# Altium project LED kocka.PrjPcb
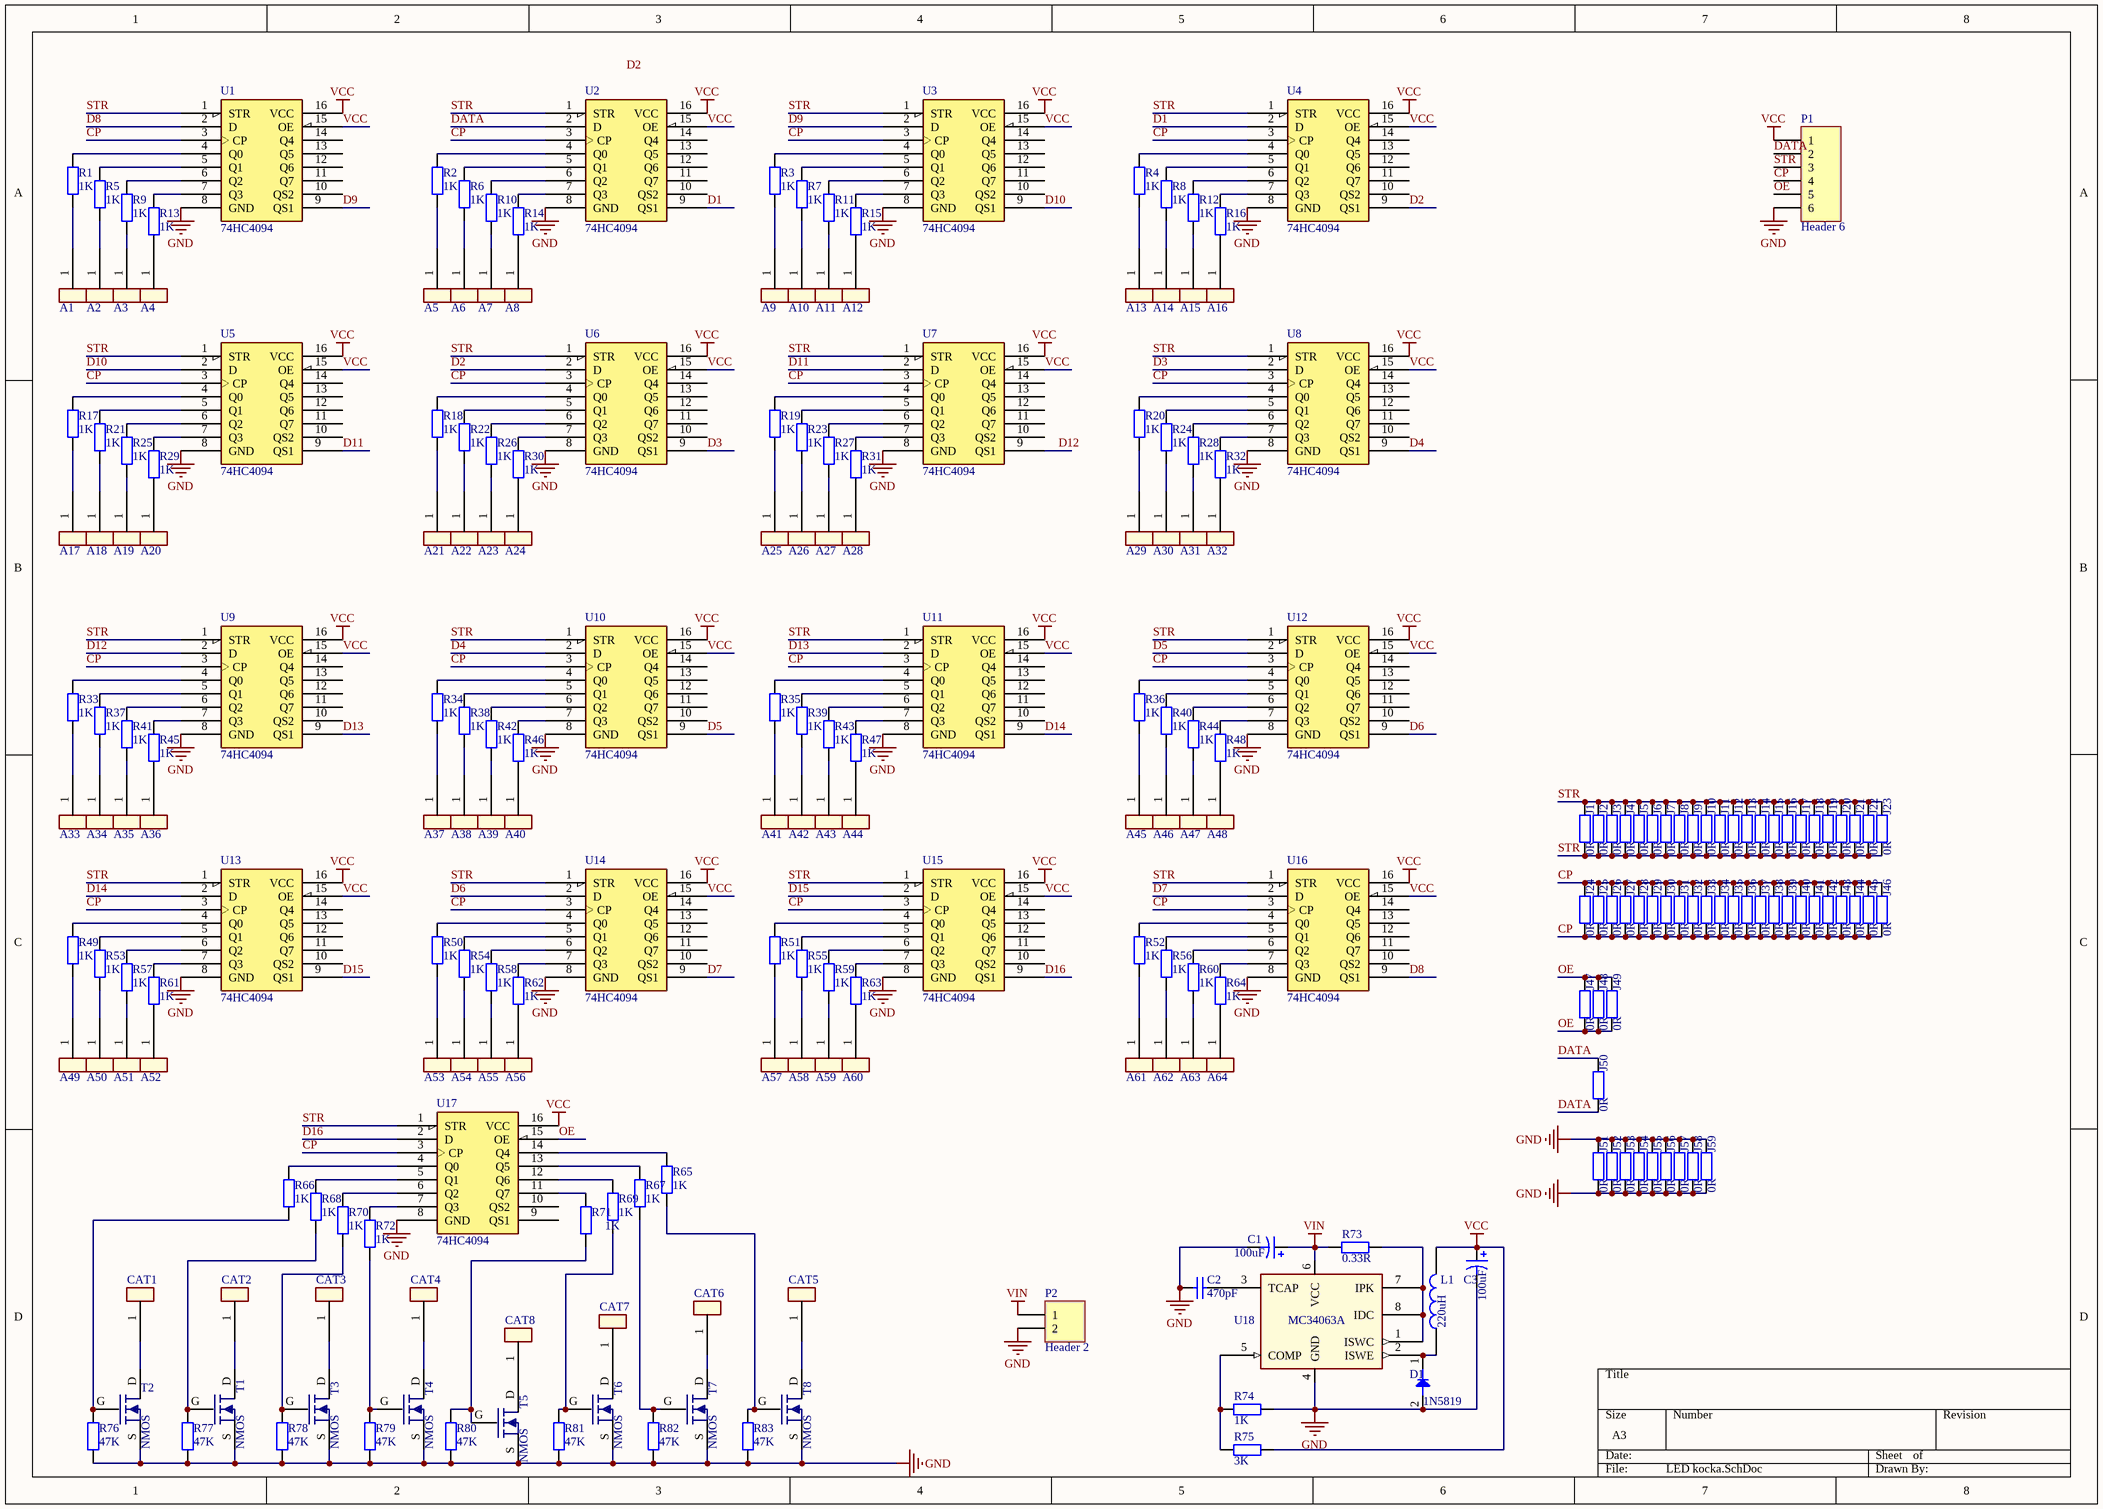
[diagram p0: LED kocka.SchDoc]
1 sheet, 247 parts. Net scope: global (net labels, ports and power ports of the same name join across sheets).
Board file: LED kocka.PcbDoc

## Sheet LED kocka.SchDoc
size A3

### Parts
A1  (no value)  [via_300x400]
A2  (no value)  [via_300x400]
A3  (no value)  [via_300x400]
A4  (no value)  [via_300x400]
A5  (no value)  [via_300x400]
A6  (no value)  [via_300x400]
A7  (no value)  [via_300x400]
A8  (no value)  [via_300x400]
A9  (no value)  [via_300x400]
A10  (no value)  [via_300x400]
A11  (no value)  [via_300x400]
A12  (no value)  [via_300x400]
A13  (no value)  [via_300x400]
A14  (no value)  [via_300x400]
A15  (no value)  [via_300x400]
A16  (no value)  [via_300x400]
A17  (no value)  [via_300x400]
A18  (no value)  [via_300x400]
A19  (no value)  [via_300x400]
A20  (no value)  [via_300x400]
A21  (no value)  [via_300x400]
A22  (no value)  [via_300x400]
A23  (no value)  [via_300x400]
A24  (no value)  [via_300x400]
A25  (no value)  [via_300x400]
A26  (no value)  [via_300x400]
A27  (no value)  [via_300x400]
A28  (no value)  [via_300x400]
A29  (no value)  [via_300x400]
A30  (no value)  [via_300x400]
A31  (no value)  [via_300x400]
A32  (no value)  [via_300x400]
A33  (no value)  [via_300x400]
A34  (no value)  [via_300x400]
A35  (no value)  [via_300x400]
A36  (no value)  [via_300x400]
A37  (no value)  [via_300x400]
A38  (no value)  [via_300x400]
A39  (no value)  [via_300x400]
A40  (no value)  [via_300x400]
A41  (no value)  [via_300x400]
A42  (no value)  [via_300x400]
A43  (no value)  [via_300x400]
A44  (no value)  [via_300x400]
A45  (no value)  [via_300x400]
A46  (no value)  [via_300x400]
A47  (no value)  [via_300x400]
A48  (no value)  [via_300x400]
A49  (no value)  [via_300x400]
A50  (no value)  [via_300x400]
A51  (no value)  [via_300x400]
A52  (no value)  [via_300x400]
A53  (no value)  [via_300x400]
A54  (no value)  [via_300x400]
A55  (no value)  [via_300x400]
A56  (no value)  [via_300x400]
A57  (no value)  [via_300x400]
A58  (no value)  [via_300x400]
A59  (no value)  [via_300x400]
A60  (no value)  [via_300x400]
A61  (no value)  [via_300x400]
A62  (no value)  [via_300x400]
A63  (no value)  [via_300x400]
A64  (no value)  [via_300x400]
C1  100uF  [FP_CAP_ELKO_6,3X6,3]
C2  470pF  [FP_0805_CAP_085]
C3  100uF  [FP_CAP_ELKO_6,3X6,3]
CAT1  (no value)  [via_300x400]
CAT2  (no value)  [via_300x400]
CAT3  (no value)  [via_300x400]
CAT4  (no value)  [via_300x400]
CAT5  (no value)  [via_300x400]
CAT6  (no value)  [via_300x400]
CAT7  (no value)  [via_300x400]
CAT8  (no value)  [via_300x400]
D1  1N5819  [FP_SOD-123]
J1  0R  [FP_1206_RES_SIMPLE]
J2  0R  [FP_1206_RES_SIMPLE]
J3  0R  [FP_1206_RES_SIMPLE]
J4  0R  [FP_1206_RES_SIMPLE]
J5  0R  [FP_1206_RES_SIMPLE]
J6  0R  [FP_1206_RES_SIMPLE]
J7  0R  [FP_1206_RES_SIMPLE]
J8  0R  [FP_1206_RES_SIMPLE]
J9  0R  [FP_1206_RES_SIMPLE]
J10  0R  [FP_1206_RES_SIMPLE]
J11  0R  [FP_1206_RES_SIMPLE]
J12  0R  [FP_1206_RES_SIMPLE]
J13  0R  [FP_1206_RES_SIMPLE]
J14  0R  [FP_1206_RES_SIMPLE]
J15  0R  [FP_1206_RES_SIMPLE]
J16  0R  [FP_1206_RES_SIMPLE]
J17  0R  [FP_1206_RES_SIMPLE]
J18  0R  [FP_1206_RES_SIMPLE]
J19  0R  [FP_1206_RES_SIMPLE]
J20  0R  [FP_1206_RES_SIMPLE]
J21  0R  [FP_1206_RES_SIMPLE]
J22  0R  [FP_1206_RES_SIMPLE]
J23  0R  [FP_1206_RES_SIMPLE]
J24  0R  [FP_1206_RES_SIMPLE]
J25  0R  [FP_1206_RES_SIMPLE]
J26  0R  [FP_1206_RES_SIMPLE]
J27  0R  [FP_1206_RES_SIMPLE]
J28  0R  [FP_1206_RES_SIMPLE]
J29  0R  [FP_1206_RES_SIMPLE]
J30  0R  [FP_1206_RES_SIMPLE]
J31  0R  [FP_1206_RES_SIMPLE]
J32  0R  [FP_1206_RES_SIMPLE]
J33  0R  [FP_1206_RES_SIMPLE]
J34  0R  [FP_1206_RES_SIMPLE]
J35  0R  [FP_1206_RES_SIMPLE]
J36  0R  [FP_1206_RES_SIMPLE]
J37  0R  [FP_1206_RES_SIMPLE]
J38  0R  [FP_1206_RES_SIMPLE]
J39  0R  [FP_1206_RES_SIMPLE]
J40  0R  [FP_1206_RES_SIMPLE]
J41  0R  [FP_1206_RES_SIMPLE]
J42  0R  [FP_1206_RES_SIMPLE]
J43  0R  [FP_1206_RES_SIMPLE]
J44  0R  [FP_1206_RES_SIMPLE]
J45  0R  [FP_1206_RES_SIMPLE]
J46  0R  [FP_1206_RES_SIMPLE]
J47  0R  [FP_1206_RES_SIMPLE]
J48  0R  [FP_1206_RES_SIMPLE]
J49  0R  [FP_1206_RES_SIMPLE]
J50  0R  [FP_1206_RES_SIMPLE]
J51  0R  [FP_1206_RES_SIMPLE]
J52  0R  [FP_1206_RES_SIMPLE]
J53  0R  [FP_1206_RES_SIMPLE]
J54  0R  [FP_1206_RES_SIMPLE]
J55  0R  [FP_1206_RES_SIMPLE]
J56  0R  [FP_1206_RES_SIMPLE]
J57  0R  [FP_1206_RES_SIMPLE]
J58  0R  [FP_1206_RES_SIMPLE]
J59  0R  [FP_1206_RES_SIMPLE]
L1  220uH  [FP_IND_MURATA3131]
P1  Header 6  [HDR1X6]
P2  Header 2  [FP_DC_TAP_ANYA]
R1  1K  [FP_0603_RES]
R2  1K  [FP_0603_RES]
R3  1K  [FP_0603_RES]
R4  1K  [FP_0603_RES]
R5  1K  [FP_0603_RES]
R6  1K  [FP_0603_RES]
R7  1K  [FP_0603_RES]
R8  1K  [FP_0603_RES]
R9  1K  [FP_0603_RES]
R10  1K  [FP_0603_RES]
R11  1K  [FP_0603_RES]
R12  1K  [FP_0603_RES]
R13  1K  [FP_0603_RES]
R14  1K  [FP_0603_RES]
R15  1K  [FP_0603_RES]
R16  1K  [FP_0603_RES]
R17  1K  [FP_0603_RES]
R18  1K  [FP_0603_RES]
R19  1K  [FP_0603_RES]
R20  1K  [FP_0603_RES]
R21  1K  [FP_0603_RES]
R22  1K  [FP_0603_RES]
R23  1K  [FP_0603_RES]
R24  1K  [FP_0603_RES]
R25  1K  [FP_0603_RES]
R26  1K  [FP_0603_RES]
R27  1K  [FP_0603_RES]
R28  1K  [FP_0603_RES]
R29  1K  [FP_0603_RES]
R30  1K  [FP_0603_RES]
R31  1K  [FP_0603_RES]
R32  1K  [FP_0603_RES]
R33  1K  [FP_0603_RES]
R34  1K  [FP_0603_RES]
R35  1K  [FP_0603_RES]
R36  1K  [FP_0603_RES]
R37  1K  [FP_0603_RES]
R38  1K  [FP_0603_RES]
R39  1K  [FP_0603_RES]
R40  1K  [FP_0603_RES]
R41  1K  [FP_0603_RES]
R42  1K  [FP_0603_RES]
R43  1K  [FP_0603_RES]
R44  1K  [FP_0603_RES]
R45  1K  [FP_0603_RES]
R46  1K  [FP_0603_RES]
R47  1K  [FP_0603_RES]
R48  1K  [FP_0603_RES]
R49  1K  [FP_0603_RES]
R50  1K  [FP_0603_RES]
R51  1K  [FP_0603_RES]
R52  1K  [FP_0603_RES]
R53  1K  [FP_0603_RES]
R54  1K  [FP_0603_RES]
R55  1K  [FP_0603_RES]
R56  1K  [FP_0603_RES]
R57  1K  [FP_0603_RES]
R58  1K  [FP_0603_RES]
R59  1K  [FP_0603_RES]
R60  1K  [FP_0603_RES]
R61  1K  [FP_0603_RES]
R62  1K  [FP_0603_RES]
R63  1K  [FP_0603_RES]
R64  1K  [FP_0603_RES]
R65  1K  [FP_0603_RES]
R66  1K  [FP_0603_RES]
R67  1K  [FP_0603_RES]
R68  1K  [FP_0603_RES]
R69  1K  [FP_0603_RES]
R70  1K  [FP_0603_RES]
R71  1K  [FP_0603_RES]
R72  1K  [FP_0603_RES]
R73  0.33R  [FP_0805_RES]
R74  1K  [FP_0805_RES]
R75  3K  [FP_0805_RES]
R76  47K  [FP_0603_RES]
R77  47K  [FP_0603_RES]
R78  47K  [FP_0603_RES]
R79  47K  [FP_0603_RES]
R80  47K  [FP_0603_RES]
R81  47K  [FP_0603_RES]
R82  47K  [FP_0603_RES]
R83  47K  [FP_0603_RES]
T1  NMOS  [BBMF170]
T2  NMOS  [BBMF170]
T3  NMOS  [BBMF170]
T4  NMOS  [BBMF170]
T5  NMOS  [BBMF170]
T6  NMOS  [BBMF170]
T7  NMOS  [BBMF170]
T8  NMOS  [BBMF170]
U1  74HC4094  [SOIC16]
U2  74HC4094  [SOIC16]
U3  74HC4094  [SOIC16]
U4  74HC4094  [SOIC16]
U5  74HC4094  [SOIC16]
U6  74HC4094  [SOIC16]
U7  74HC4094  [SOIC16]
U8  74HC4094  [SOIC16]
U9  74HC4094  [SOIC16]
U10  74HC4094  [SOIC16]
U11  74HC4094  [SOIC16]
U12  74HC4094  [SOIC16]
U13  74HC4094  [SOIC16]
U14  74HC4094  [SOIC16]
U15  74HC4094  [SOIC16]
U16  74HC4094  [SOIC16]
U17  74HC4094  [SOIC16]
U18  MC34063A  [FP_SO8_MS012AA]

### Nets
GND: C1.N C2.1 C3.N D1.2 J51.1 J51.2 J52.1 J52.2 J53.1 J53.2 J54.1 J54.2 J55.1 J55.2 J56.1 J56.2 J57.1 J57.2 J58.1 J58.2 J59.1 J59.2 P1.6 P2.2 R74.2 R76.2 R77.2 R78.2 R79.2 R80.2 R81.2 R82.2 R83.1 T1.S T2.S T3.S T4.S T5.S T6.S T7.S T8.S U1.8(GND) U2.8(GND) U3.8(GND) U4.8(GND) U5.8(GND) U6.8(GND) U7.8(GND) U8.8(GND) U9.8(GND) U10.8(GND) U11.8(GND) U12.8(GND) U13.8(GND) U14.8(GND) U15.8(GND) U16.8(GND) U17.8(GND) U18.4(GND)
VCC: C3.P L1.2 P1.1 R75.2 U1.15(OE) U1.16(VCC) U2.15(OE) U2.16(VCC) U3.15(OE) U3.16(VCC) U4.15(OE) U4.16(VCC) U5.15(OE) U5.16(VCC) U6.15(OE) U6.16(VCC) U7.15(OE) U7.16(VCC) U8.15(OE) U8.16(VCC) U9.15(OE) U9.16(VCC) U10.15(OE) U10.16(VCC) U11.15(OE) U11.16(VCC) U12.15(OE) U12.16(VCC) U13.15(OE) U13.16(VCC) U14.15(OE) U14.16(VCC) U15.15(OE) U15.16(VCC) U16.15(OE) U16.16(VCC) U17.16(VCC)
VIN: C1.P P2.1 R73.1 U18.6(VCC)
CP: J24.1 J24.2 J25.1 J25.2 J26.1 J26.2 J27.1 J27.2 J28.1 J28.2 J29.1 J29.2 J30.1 J30.2 J31.1 J31.2 J32.1 J32.2 J33.1 J33.2 J34.1 J34.2 J35.1 J35.2 J36.1 J36.2 J37.1 J37.2 J38.1 J38.2 J39.1 J39.2 J40.1 J40.2 J41.1 J41.2 J42.1 J42.2 J43.1 J43.2 J44.1 J44.2 J45.1 J45.2 J46.1 J46.2 P1.4 U1.3(CP) U2.3(CP) U3.3(CP) U4.3(CP) U5.3(CP) U6.3(CP) U7.3(CP) U8.3(CP) U9.3(CP) U10.3(CP) U11.3(CP) U12.3(CP) U13.3(CP) U14.3(CP) U15.3(CP) U16.3(CP) U17.3(CP)
D1: U2.9(QS1) U4.2(D)
D2: U4.9(QS1) U6.2(D)
D3: U6.9(QS1) U8.2(D)
D4: U8.9(QS1) U10.2(D)
D5: U10.9(QS1) U12.2(D)
D6: U12.9(QS1) U14.2(D)
D7: U14.9(QS1) U16.2(D)
D8: U1.2(D) U16.9(QS1)
D9: U1.9(QS1) U3.2(D)
D10: U3.9(QS1) U5.2(D)
D11: U5.9(QS1) U7.2(D)
D12: U7.9(QS1) U9.2(D)
D13: U9.9(QS1) U11.2(D)
D14: U11.9(QS1) U13.2(D)
D15: U13.9(QS1) U15.2(D)
D16: U15.9(QS1) U17.2(D)
DATA: J50.1 J50.2 P1.2 U2.2(D)
OE: J47.1 J47.2 J48.1 J48.2 J49.1 J49.2 P1.5 U17.15(OE)
STR: J1.1 J1.2 J2.1 J2.2 J3.1 J3.2 J4.1 J4.2 J5.1 J5.2 J6.1 J6.2 J7.1 J7.2 J8.1 J8.2 J9.1 J9.2 J10.1 J10.2 J11.1 J11.2 J12.1 J12.2 J13.1 J13.2 J14.1 J14.2 J15.1 J15.2 J16.1 J16.2 J17.1 J17.2 J18.1 J18.2 J19.1 J19.2 J20.1 J20.2 J21.1 J21.2 J22.1 J22.2 J23.1 J23.2 P1.3 U1.1(STR) U2.1(STR) U3.1(STR) U4.1(STR) U5.1(STR) U6.1(STR) U7.1(STR) U8.1(STR) U9.1(STR) U10.1(STR) U11.1(STR) U12.1(STR) U13.1(STR) U14.1(STR) U15.1(STR) U16.1(STR) U17.1(STR)
NetA1_1: A1.1 R1.1
NetA2_1: A2.1 R5.1
NetA3_1: A3.1 R9.1
NetA4_1: A4.1 R13.1
NetA5_1: A5.1 R2.1
NetA6_1: A6.1 R6.1
NetA7_1: A7.1 R10.1
NetA8_1: A8.1 R14.1
NetA9_1: A9.1 R3.1
NetA10_1: A10.1 R7.1
NetA11_1: A11.1 R11.1
NetA12_1: A12.1 R15.1
NetA13_1: A13.1 R4.1
NetA14_1: A14.1 R8.1
NetA15_1: A15.1 R12.1
NetA16_1: A16.1 R16.1
NetA17_1: A17.1 R17.1
NetA18_1: A18.1 R21.1
NetA19_1: A19.1 R25.1
NetA20_1: A20.1 R29.1
NetA21_1: A21.1 R18.1
NetA22_1: A22.1 R22.1
NetA23_1: A23.1 R26.1
NetA24_1: A24.1 R30.1
NetA25_1: A25.1 R19.1
NetA26_1: A26.1 R23.1
NetA27_1: A27.1 R27.1
NetA28_1: A28.1 R31.1
NetA29_1: A29.1 R20.1
NetA30_1: A30.1 R24.1
NetA31_1: A31.1 R28.1
NetA32_1: A32.1 R32.1
NetA33_1: A33.1 R33.1
NetA34_1: A34.1 R37.1
NetA35_1: A35.1 R41.1
NetA36_1: A36.1 R45.1
NetA37_1: A37.1 R34.1
NetA38_1: A38.1 R38.1
NetA39_1: A39.1 R42.1
NetA40_1: A40.1 R46.1
NetA41_1: A41.1 R35.1
NetA42_1: A42.1 R39.1
NetA43_1: A43.1 R43.1
NetA44_1: A44.1 R47.1
NetA45_1: A45.1 R36.1
NetA46_1: A46.1 R40.1
NetA47_1: A47.1 R44.1
NetA48_1: A48.1 R48.1
NetA49_1: A49.1 R49.1
NetA50_1: A50.1 R53.1
NetA51_1: A51.1 R57.1
NetA52_1: A52.1 R61.1
NetA53_1: A53.1 R50.1
NetA54_1: A54.1 R54.1
NetA55_1: A55.1 R58.1
NetA56_1: A56.1 R62.1
NetA57_1: A57.1 R51.1
NetA58_1: A58.1 R55.1
NetA59_1: A59.1 R59.1
NetA60_1: A60.1 R63.1
NetA61_1: A61.1 R52.1
NetA62_1: A62.1 R56.1
NetA63_1: A63.1 R60.1
NetA64_1: A64.1 R64.1
NetC2_2: C2.2 U18.3(TCAP)
NetCAT1_1: CAT1.1 T2.D
NetCAT2_1: CAT2.1 T1.D
NetCAT3_1: CAT3.1 T3.D
NetCAT4_1: CAT4.1 T4.D
NetCAT5_1: CAT5.1 T8.D
NetCAT6_1: CAT6.1 T7.D
NetCAT7_1: CAT7.1 T6.D
NetCAT8_1: CAT8.1 T5.D
NetD1_1: D1.1 L1.1 U18.2(ISWE)
NetR1_2: R1.2 U1.4(Q0)
NetR2_2: R2.2 U2.4(Q0)
NetR3_2: R3.2 U3.4(Q0)
NetR4_2: R4.2 U4.4(Q0)
NetR5_2: R5.2 U1.5(Q1)
NetR6_2: R6.2 U2.5(Q1)
NetR7_2: R7.2 U3.5(Q1)
NetR8_2: R8.2 U4.5(Q1)
NetR9_2: R9.2 U1.6(Q2)
NetR10_2: R10.2 U2.6(Q2)
NetR11_2: R11.2 U3.6(Q2)
NetR12_2: R12.2 U4.6(Q2)
NetR13_2: R13.2 U1.7(Q3)
NetR14_2: R14.2 U2.7(Q3)
NetR15_2: R15.2 U3.7(Q3)
NetR16_2: R16.2 U4.7(Q3)
NetR17_2: R17.2 U5.4(Q0)
NetR18_2: R18.2 U6.4(Q0)
NetR19_2: R19.2 U7.4(Q0)
NetR20_2: R20.2 U8.4(Q0)
NetR21_2: R21.2 U5.5(Q1)
NetR22_2: R22.2 U6.5(Q1)
NetR23_2: R23.2 U7.5(Q1)
NetR24_2: R24.2 U8.5(Q1)
NetR25_2: R25.2 U5.6(Q2)
NetR26_2: R26.2 U6.6(Q2)
NetR27_2: R27.2 U7.6(Q2)
NetR28_2: R28.2 U8.6(Q2)
NetR29_2: R29.2 U5.7(Q3)
NetR30_2: R30.2 U6.7(Q3)
NetR31_2: R31.2 U7.7(Q3)
NetR32_2: R32.2 U8.7(Q3)
NetR33_2: R33.2 U9.4(Q0)
NetR34_2: R34.2 U10.4(Q0)
NetR35_2: R35.2 U11.4(Q0)
NetR36_2: R36.2 U12.4(Q0)
NetR37_2: R37.2 U9.5(Q1)
NetR38_2: R38.2 U10.5(Q1)
NetR39_2: R39.2 U11.5(Q1)
NetR40_2: R40.2 U12.5(Q1)
NetR41_2: R41.2 U9.6(Q2)
NetR42_2: R42.2 U10.6(Q2)
NetR43_2: R43.2 U11.6(Q2)
NetR44_2: R44.2 U12.6(Q2)
NetR45_2: R45.2 U9.7(Q3)
NetR46_2: R46.2 U10.7(Q3)
NetR47_2: R47.2 U11.7(Q3)
NetR48_2: R48.2 U12.7(Q3)
NetR49_2: R49.2 U13.4(Q0)
NetR50_2: R50.2 U14.4(Q0)
NetR51_2: R51.2 U15.4(Q0)
NetR52_2: R52.2 U16.4(Q0)
NetR53_2: R53.2 U13.5(Q1)
NetR54_2: R54.2 U14.5(Q1)
NetR55_2: R55.2 U15.5(Q1)
NetR56_2: R56.2 U16.5(Q1)
NetR57_2: R57.2 U13.6(Q2)
NetR58_2: R58.2 U14.6(Q2)
NetR59_2: R59.2 U15.6(Q2)
NetR60_2: R60.2 U16.6(Q2)
NetR61_2: R61.2 U13.7(Q3)
NetR62_2: R62.2 U14.7(Q3)
NetR63_2: R63.2 U15.7(Q3)
NetR64_2: R64.2 U16.7(Q3)
NetR65_1: R65.1 R83.2 T8.G
NetR65_2: R65.2 U17.14(Q4)
NetR66_1: R66.1 R76.1 T2.G
NetR66_2: R66.2 U17.4(Q0)
NetR67_1: R67.1 R82.1 T7.G
NetR67_2: R67.2 U17.13(Q5)
NetR68_1: R68.1 R77.1 T1.G
NetR68_2: R68.2 U17.5(Q1)
NetR69_1: R69.1 R81.1 T6.G
NetR69_2: R69.2 U17.12(Q6)
NetR70_1: R70.1 R78.1 T3.G
NetR70_2: R70.2 U17.6(Q2)
NetR71_1: R71.1 R80.1 T5.G
NetR71_2: R71.2 U17.11(Q7)
NetR72_1: R72.1 R79.1 T4.G
NetR72_2: R72.2 U17.7(Q3)
NetR73_2: R73.2 U18.1(ISWC) U18.7(IPK) U18.8(IDC)
NetR74_1: R74.1 R75.1 U18.5(COMP)

Not connected (* = marked no-connect by the designer): U1 10(QS2) 11(Q7) 12(Q6) 13(Q5) 14(Q4); U2 10(QS2) 11(Q7) 12(Q6) 13(Q5) 14(Q4); U3 10(QS2) 11(Q7) 12(Q6) 13(Q5) 14(Q4); U4 10(QS2) 11(Q7) 12(Q6) 13(Q5) 14(Q4); U5 10(QS2) 11(Q7) 12(Q6) 13(Q5) 14(Q4); U6 10(QS2) 11(Q7) 12(Q6) 13(Q5) 14(Q4); U7 10(QS2) 11(Q7) 12(Q6) 13(Q5) 14(Q4); U8 10(QS2) 11(Q7) 12(Q6) 13(Q5) 14(Q4); U9 10(QS2) 11(Q7) 12(Q6) 13(Q5) 14(Q4); U10 10(QS2) 11(Q7) 12(Q6) 13(Q5) 14(Q4); U11 10(QS2) 11(Q7) 12(Q6) 13(Q5) 14(Q4); U12 10(QS2) 11(Q7) 12(Q6) 13(Q5) 14(Q4); U13 10(QS2) 11(Q7) 12(Q6) 13(Q5) 14(Q4); U14 10(QS2) 11(Q7) 12(Q6) 13(Q5) 14(Q4); U15 10(QS2) 11(Q7) 12(Q6) 13(Q5) 14(Q4); U16 10(QS2) 11(Q7) 12(Q6) 13(Q5) 14(Q4); U17 9(QS1) 10(QS2)

### Notes on the sheet
- Labels drawn without touching a wire or pin: D2

### Library data of the parts
A1-A64 CAT1-CAT8 = TestPoint
C1 C3 = CAP_ELECT: Polarized Capacitor; Value: 100uF
C2 = CAP: Capacitor; Value: 470pF
D1 = DIODE
J1-J59 R1-R83 = RES: Resistor
  J1-J59: Value: 0R
  R1-R72 R74: Value: 1K
  R73: Value: 0.33R
  R75: Value: 3K
  R76-R83: Value: 47K
L1 = IND: Inductor; Value: 220uH
P1 = Header 6: Header, 6-Pin; LatestRevisionDate: 17-Jul-2002; LatestRevisionNote: Re-released for DXP Platform.; Publisher: Altium Limited
P2 = Header 2: Header, 2-Pin; LatestRevisionDate: 17-Jul-2002; LatestRevisionNote: Re-released for DXP Platform.; Publisher: Altium Limited
U1-U17 = 74HC4094: shift reg